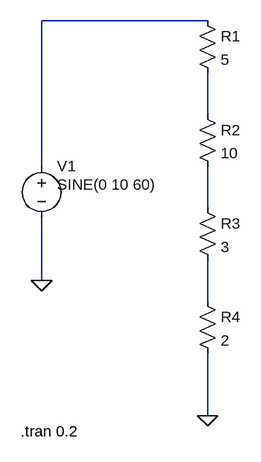
[diagram p0: schematic Basic Voltage Divider Circuit.asc]
Basic Voltage Divider Circuit.asc, the LTspice schematic file:
Version 4.1
SHEET 1 880 680
WIRE 272 -96 16 -96
WIRE 272 48 272 -16
WIRE 16 128 16 -96
WIRE 272 192 272 128
WIRE 16 304 16 208
WIRE 272 336 272 272
WIRE 272 512 272 416
FLAG 16 304 0
FLAG 272 512 0
SYMBOL voltage 16 112 R0
WINDOW 3 24 44 Left 2
WINDOW 123 0 0 Left 0
WINDOW 39 0 0 Left 0
SYMATTR InstName V1
SYMATTR Value SINE(0 10 60)
SYMBOL res 256 -112 R0
SYMATTR InstName R1
SYMATTR Value 5
SYMBOL res 256 32 R0
SYMATTR InstName R2
SYMATTR Value 10
SYMBOL res 256 176 R0
SYMATTR InstName R3
SYMATTR Value 3
SYMBOL res 256 320 R0
SYMATTR InstName R4
SYMATTR Value 2
TEXT -16 536 Left 2 !.tran 0.2

The netlist it stands for:
* Basic Voltage Divider Circuit.asc
V1 N001 0 SINE(0 10 60)
R1 N001 N002 5
R2 N002 N003 10
R3 N003 N004 3
R4 N004 0 2
.tran 0.2
.backanno
.end